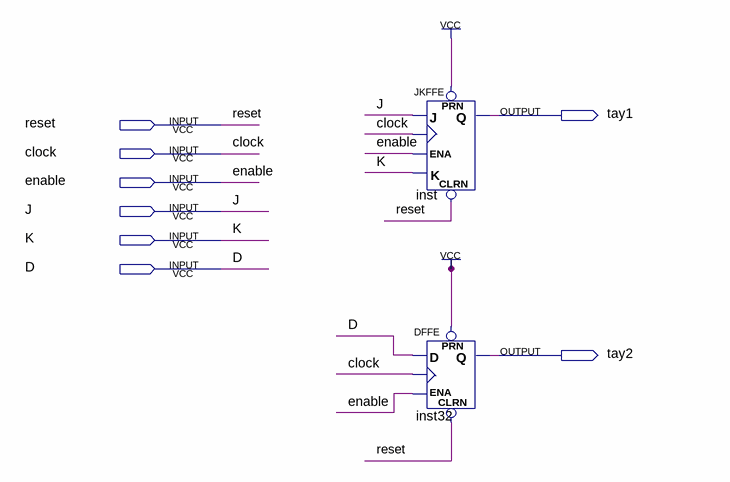
[diagram p0: schematic sheet]
// Quartus schematic mealy_mem_scheme.bdf as structural Verilog: 2 symbols, 8 pins
module mealy_mem_scheme (
  input  reset,
  input  clock,
  input  enable,
  input  J,
  input  K,
  input  D,
  output tay1,
  output tay2
);

  JKFFE inst (.PRN(1'b1), .J(J), .CLK(clock), .CLRN(reset), .K(K), .ENA(enable), .Q(tay1));
  DFFE inst32 (.PRN(1'b1), .CLRN(reset), .D(D), .CLK(clock), .ENA(enable), .Q(tay2));
endmodule
